# EAGLE schematic 315_gps_neom8u (EAGLE 9.6.2)
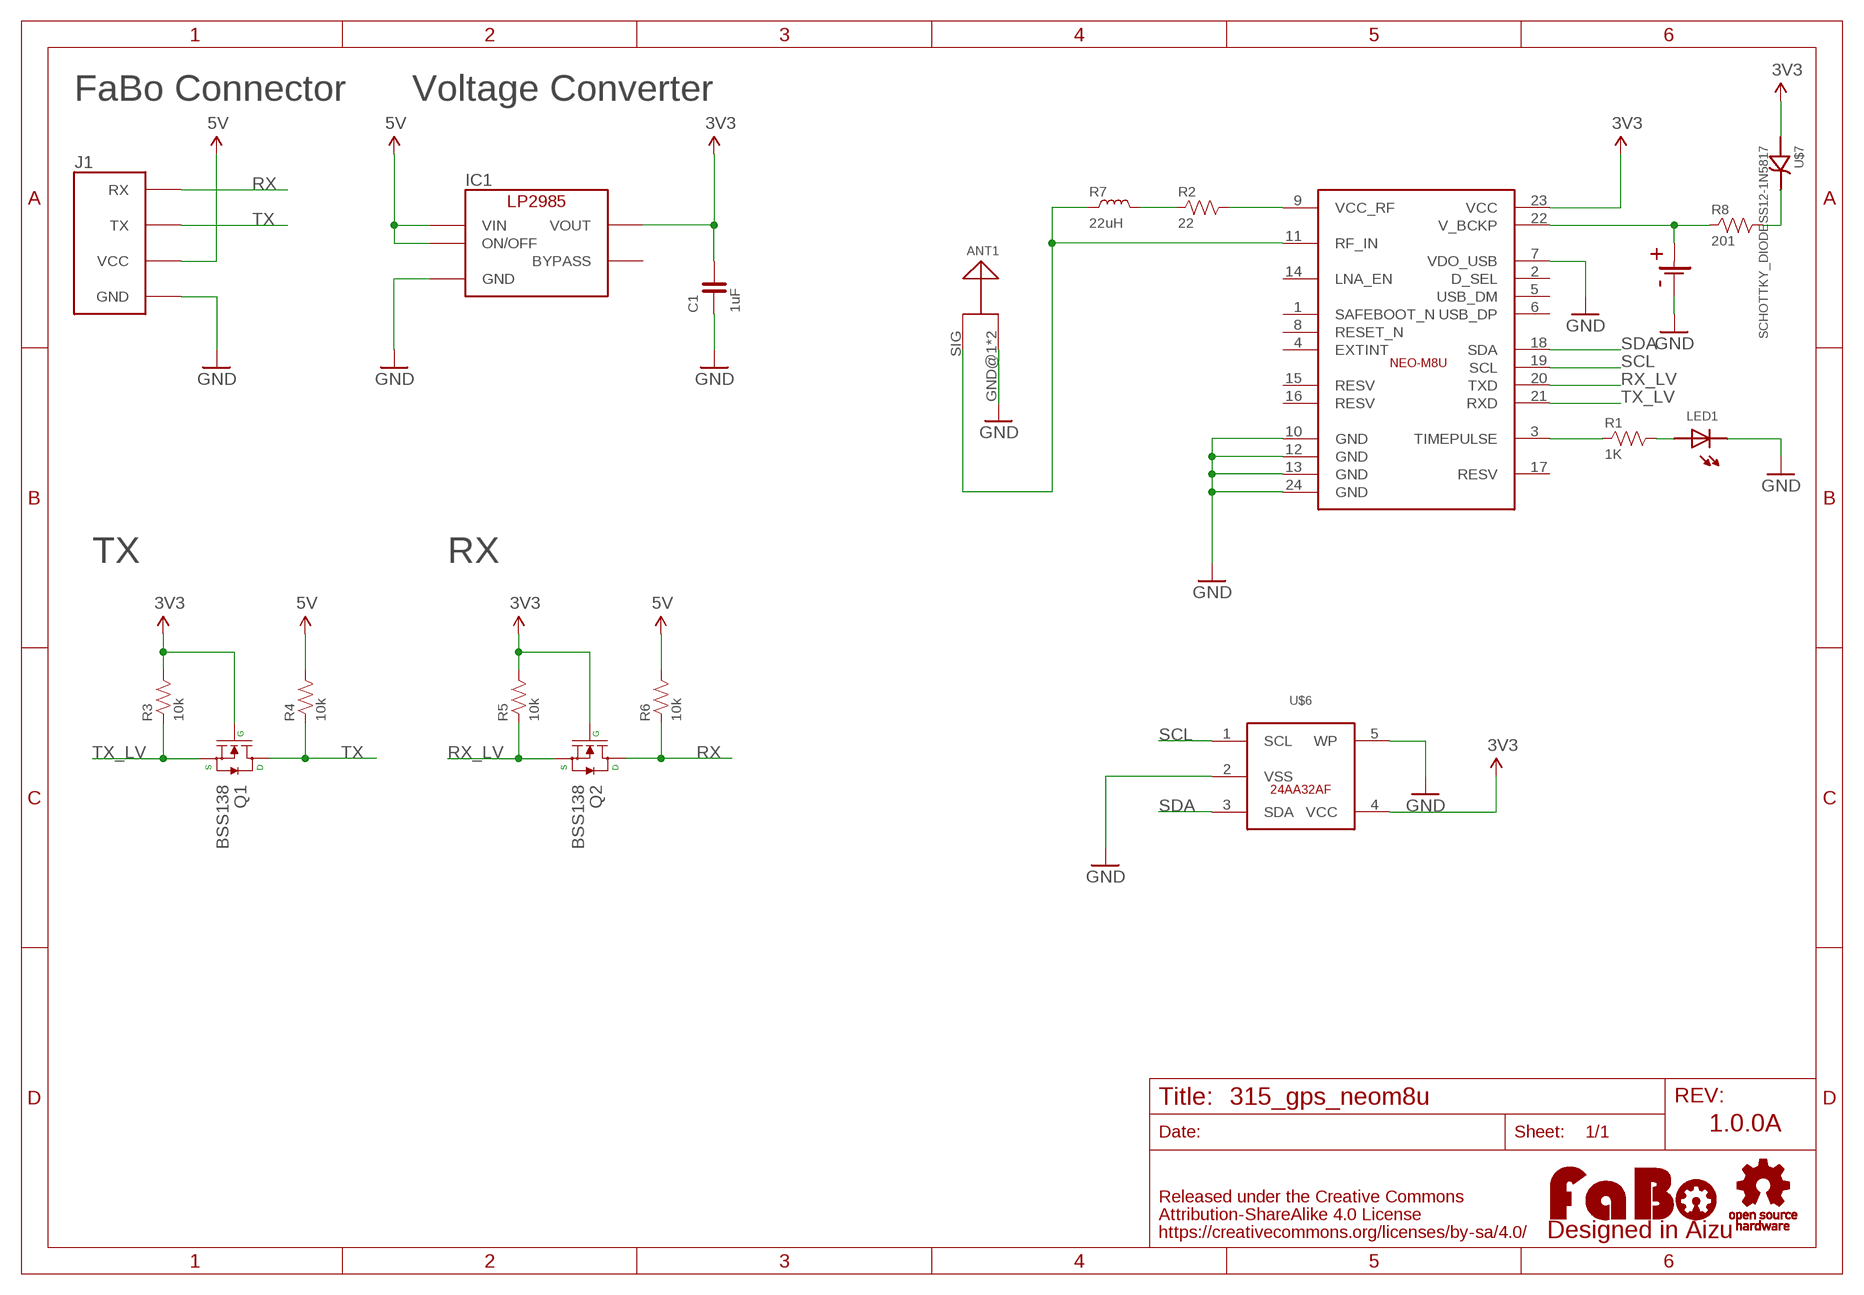
[diagram p0: schematic, sheet 1]

## Parts
ANT1  ANTENA_HIROSE-UF-L  [HIROSE-UF-L]
C1  1uF  CAPACITOR-0603_NARROW  [0603-NARROW]
IC1  LP2985-33DBV  [SOT-23-5]
J1  FABO_BRICK_SERIAL  [FABO_BRICK_SERIAL]
LED1  LED-0603  [0603]
LOGO1  LOGO_FABO-M_BOTTOM  [LOGO_FABO_M_BOTTOM]
Q1  BSS138  MOSFET-N-BSS138  [SOT23-3]
Q2  BSS138  MOSFET-N-BSS138  [SOT23-3]
R1  1K  RESISTOR-0603-NARROW  [0603-NARROW]
R2  22  RESISTOR-0603-NARROW  [0603-NARROW]
R3  10k  RESISTOR-0603-NARROW  [0603-NARROW]
R4  10k  RESISTOR-0603-NARROW  [0603-NARROW]
R5  10k  RESISTOR-0603-NARROW  [0603-NARROW]
R6  10k  RESISTOR-0603-NARROW  [0603-NARROW]
R7  22uH  COIL-0603  [0603]
R8  201  RESISTOR-0603-NARROW  [0603-NARROW]
U$2  LOGO_OSHW-M_BOTTOM  [LOGO_OSHW_M_BOTTOM]
U$4  NEO-M8U  [NEO-M8M]
U$6  24AA32AF  [24AA32AF]
U$7  SCHOTTKY_DIODESS12-1N5817  [DO-214AC]
U$10  COILCELLBK-885-BOTTOM  [BK-885]

## Nets
3V3: C1.2 IC1.5(VOUT) Q1.1(G) Q2.1(G) R3.2 R5.2 U$4.23(VCC) U$6.4(VCC) U$7.CATHODE
5V: IC1.1(VIN) IC1.3(ON/OFF) J1.VCC R4.2 R6.2
GND: ANT1.GND@1(GND) ANT1.GND@2(GND) C1.1 IC1.2(GND) J1.GND LED1.CATHODE U$4.7(VDO_USB) U$4.10(GND) U$4.12(GND) U$4.13(GND) U$4.24(GND) U$6.2(VSS) U$6.5(WP) U$10.GND1(-) U$10.GND2(-)
N$1: R1.1 U$4.3(TIMEPULSE)
N$2: LED1.ANODE R1.2
N$3: R8.2 U$7.ANODE
N$4: R8.1 U$4.22(V_BCKP) U$10.VCC(+)
N$5: R2.2 U$4.9(VCC_RF)
N$6: R2.1 R7.2
N$7: ANT1.SIG R7.1 U$4.11(RF_IN)
RX: J1.RX Q2.3(D) R6.1
RX_LV: Q2.2(S) R5.1 U$4.20(TXD)
SCL: U$4.19(SCL) U$6.1(SCL)
SDA: U$4.18(SDA) U$6.3(SDA)
TX: J1.TX Q1.3(D) R4.1
TX_LV: Q1.2(S) R3.1 U$4.21(RXD)
Unconnected: IC1.4(BYPASS) U$4.1(SAFEBOOT_N) U$4.2(D_SEL) U$4.4(EXTINT) U$4.5(USB_DM) U$4.6(USB_DP) U$4.8(RESET_N) U$4.14(LNA_EN) U$4.15(RESV) U$4.16(RESV) U$4.17(RESV)

## Notes on the sheet
- FaBo Connector | Voltage Converter
- TX | RX
- 1.0.0A

## Library data of the parts
ANT1 = FaBo-Antena:ANTENA
C1 = FaBo-Capacitor:CAPACITOR: CAPACITOR
IC1 = FaBo-Supply:LP2985: LP2985
J1 = FaBo-Template:FABO_BRICK_SERIAL: FaBo Brick Serial
LED1 = FaBo-LED:LED
LOGO1 = component:LOGO_FABO
Q1 Q2 = FaBo-etc:MOSFET-N
R1-R6 R8 = FaBo-Resistors:RESISTOR: RESISTOR
R7 = FaBo-Coil:COIL: RESISTOR
U$2 = FaBo-etc:LOGO_OSHW
U$4 = FaBo-GPS:NEO-M8U
U$6 = FaBo-EEPROM:24AA32AF
U$7 = FaBo-Diode:SCHOTTKY_DIODE
U$10 = FaBo-Supply:COILCELL